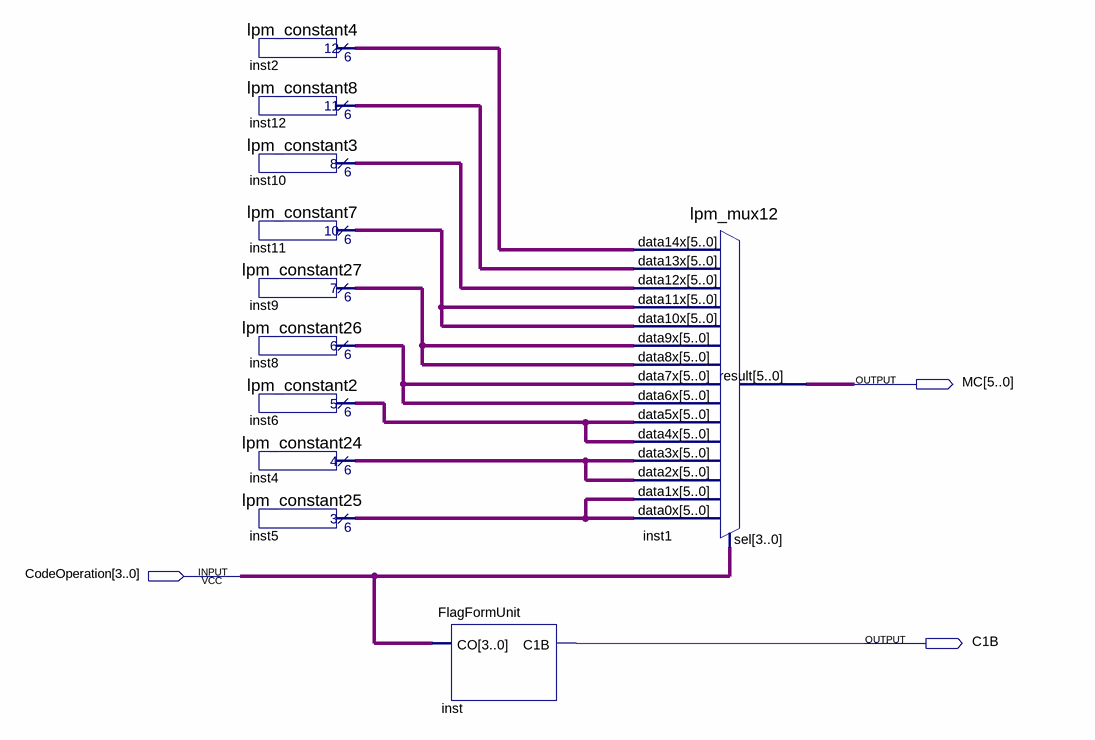
[diagram p0: schematic sheet]
// Quartus schematic DecodeCommand.bdf as structural Verilog: 11 symbols, 3 pins
module DecodeCommand (
  input  [3:0] CodeOperation,
  output [5:0] MC,
  output C1B
);

  wire [5:0] inst2_result, inst4_result, inst5_result, inst6_result, inst8_result, inst9_result,
       inst10_result, inst11_result, inst12_result;

  lpm_constant4 inst2 (.result(inst2_result));
  lpm_constant8 inst12 (.result(inst12_result));
  lpm_constant3 inst10 (.result(inst10_result));
  lpm_constant7 inst11 (.result(inst11_result));
  lpm_constant27 inst9 (.result(inst9_result));
  lpm_constant26 inst8 (.result(inst8_result));
  lpm_constant2 inst6 (.result(inst6_result));
  lpm_constant24 inst4 (.result(inst4_result));
  lpm_constant25 inst5 (.result(inst5_result));
  FlagFormUnit inst (.CO(CodeOperation), .C1B(C1B));
  lpm_mux12 inst1 (
    .data14x(inst2_result), .data13x(inst12_result), .data12x(inst10_result), .data11x(inst11_result),
    .data10x(inst11_result), .data9x(inst9_result), .data8x(inst9_result), .data7x(inst8_result),
    .data6x(inst8_result), .data5x(inst6_result), .data4x(inst6_result), .data3x(inst4_result),
    .data2x(inst4_result), .data1x(inst5_result), .data0x(inst5_result), .sel(CodeOperation), .result(MC));
endmodule
